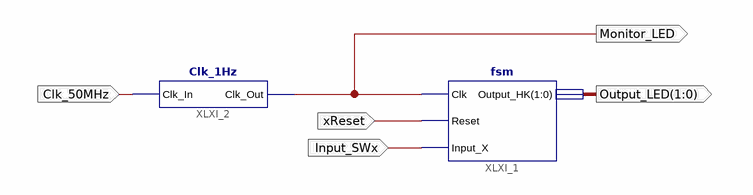
[diagram p0: schematic sheet 1]
// Xilinx ISE schematic sd.sch (spartan6) as structural Verilog: 2 symbols, 5 ports
module sd (
  input  xReset,
  input  Input_SWx,
  input  Clk_50MHz,
  output Monitor_LED,
  output [1:0] Output_LED
);

  fsm XLXI_1 (.Clk(Monitor_LED), .Reset(xReset), .Input_X(Input_SWx), .Output_HK(Output_LED));
  Clk_1Hz XLXI_2 (.Clk_In(Clk_50MHz), .Clk_Out(Monitor_LED));
endmodule
